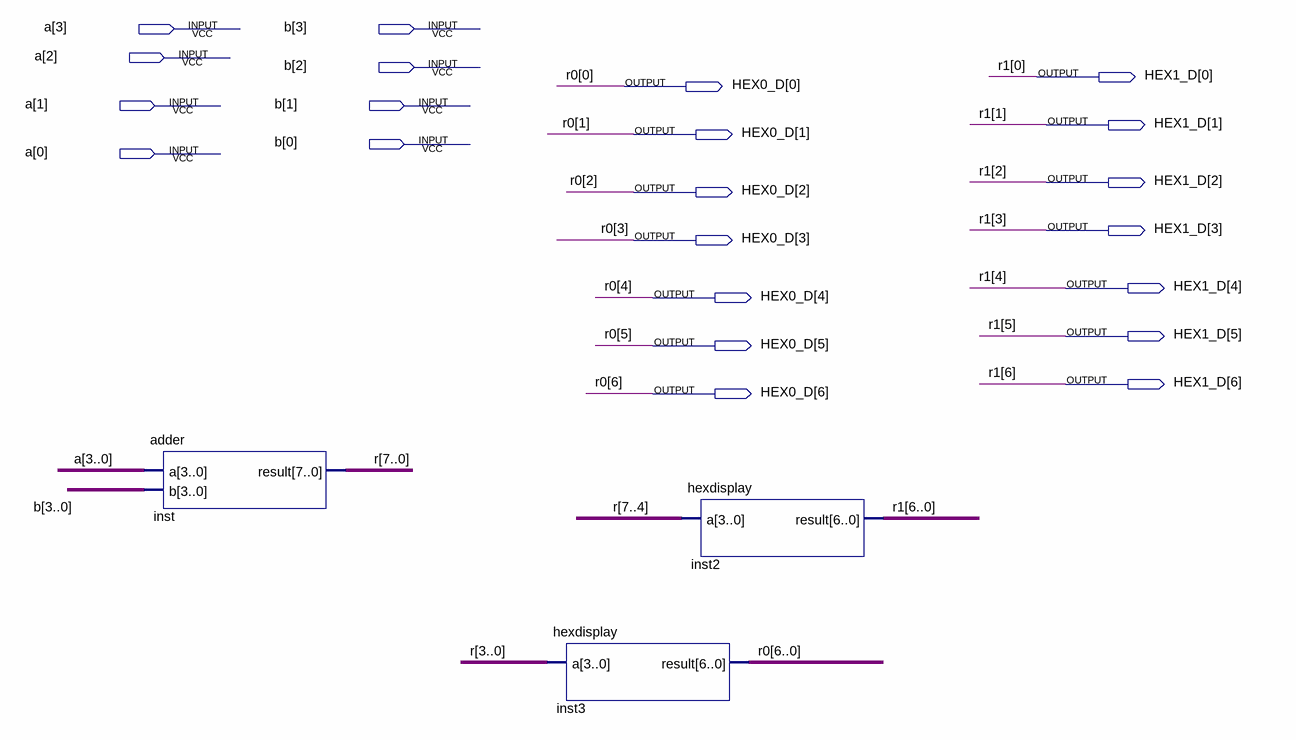
[diagram p0: schematic sheet]
// Quartus schematic task2.bdf as structural Verilog: 3 symbols, 22 pins
module task2 (
  input  [3:0] a,
  input  [3:0] b,
  output [6:0] HEX1_D,
  output [6:0] HEX0_D
);

  wire [7:0] r;

  adder inst (.a(a), .b(b), .result(r));
  hexdisplay inst3 (.a(r[3:0]), .result(HEX0_D));
  hexdisplay inst2 (.a(r[7:4]), .result(HEX1_D));

  // Other names for the same wires on the sheet: r0[6:0] = HEX0_D; r1[6:0] = HEX1_D
endmodule
